# EasyEDA Pro project 电机线限位线中继板V1.0.eprj

# Schematic 原理图
Board Name: esp32; Create Date: 2025-05-14; Page Name: 电源; Project Name: 电机线限位线中继板V1.0; Schematic Name: 原理图; Update Date: 2025-10-10; Company: 嘉立创EDA; Page Size: A3; Version: V1.0
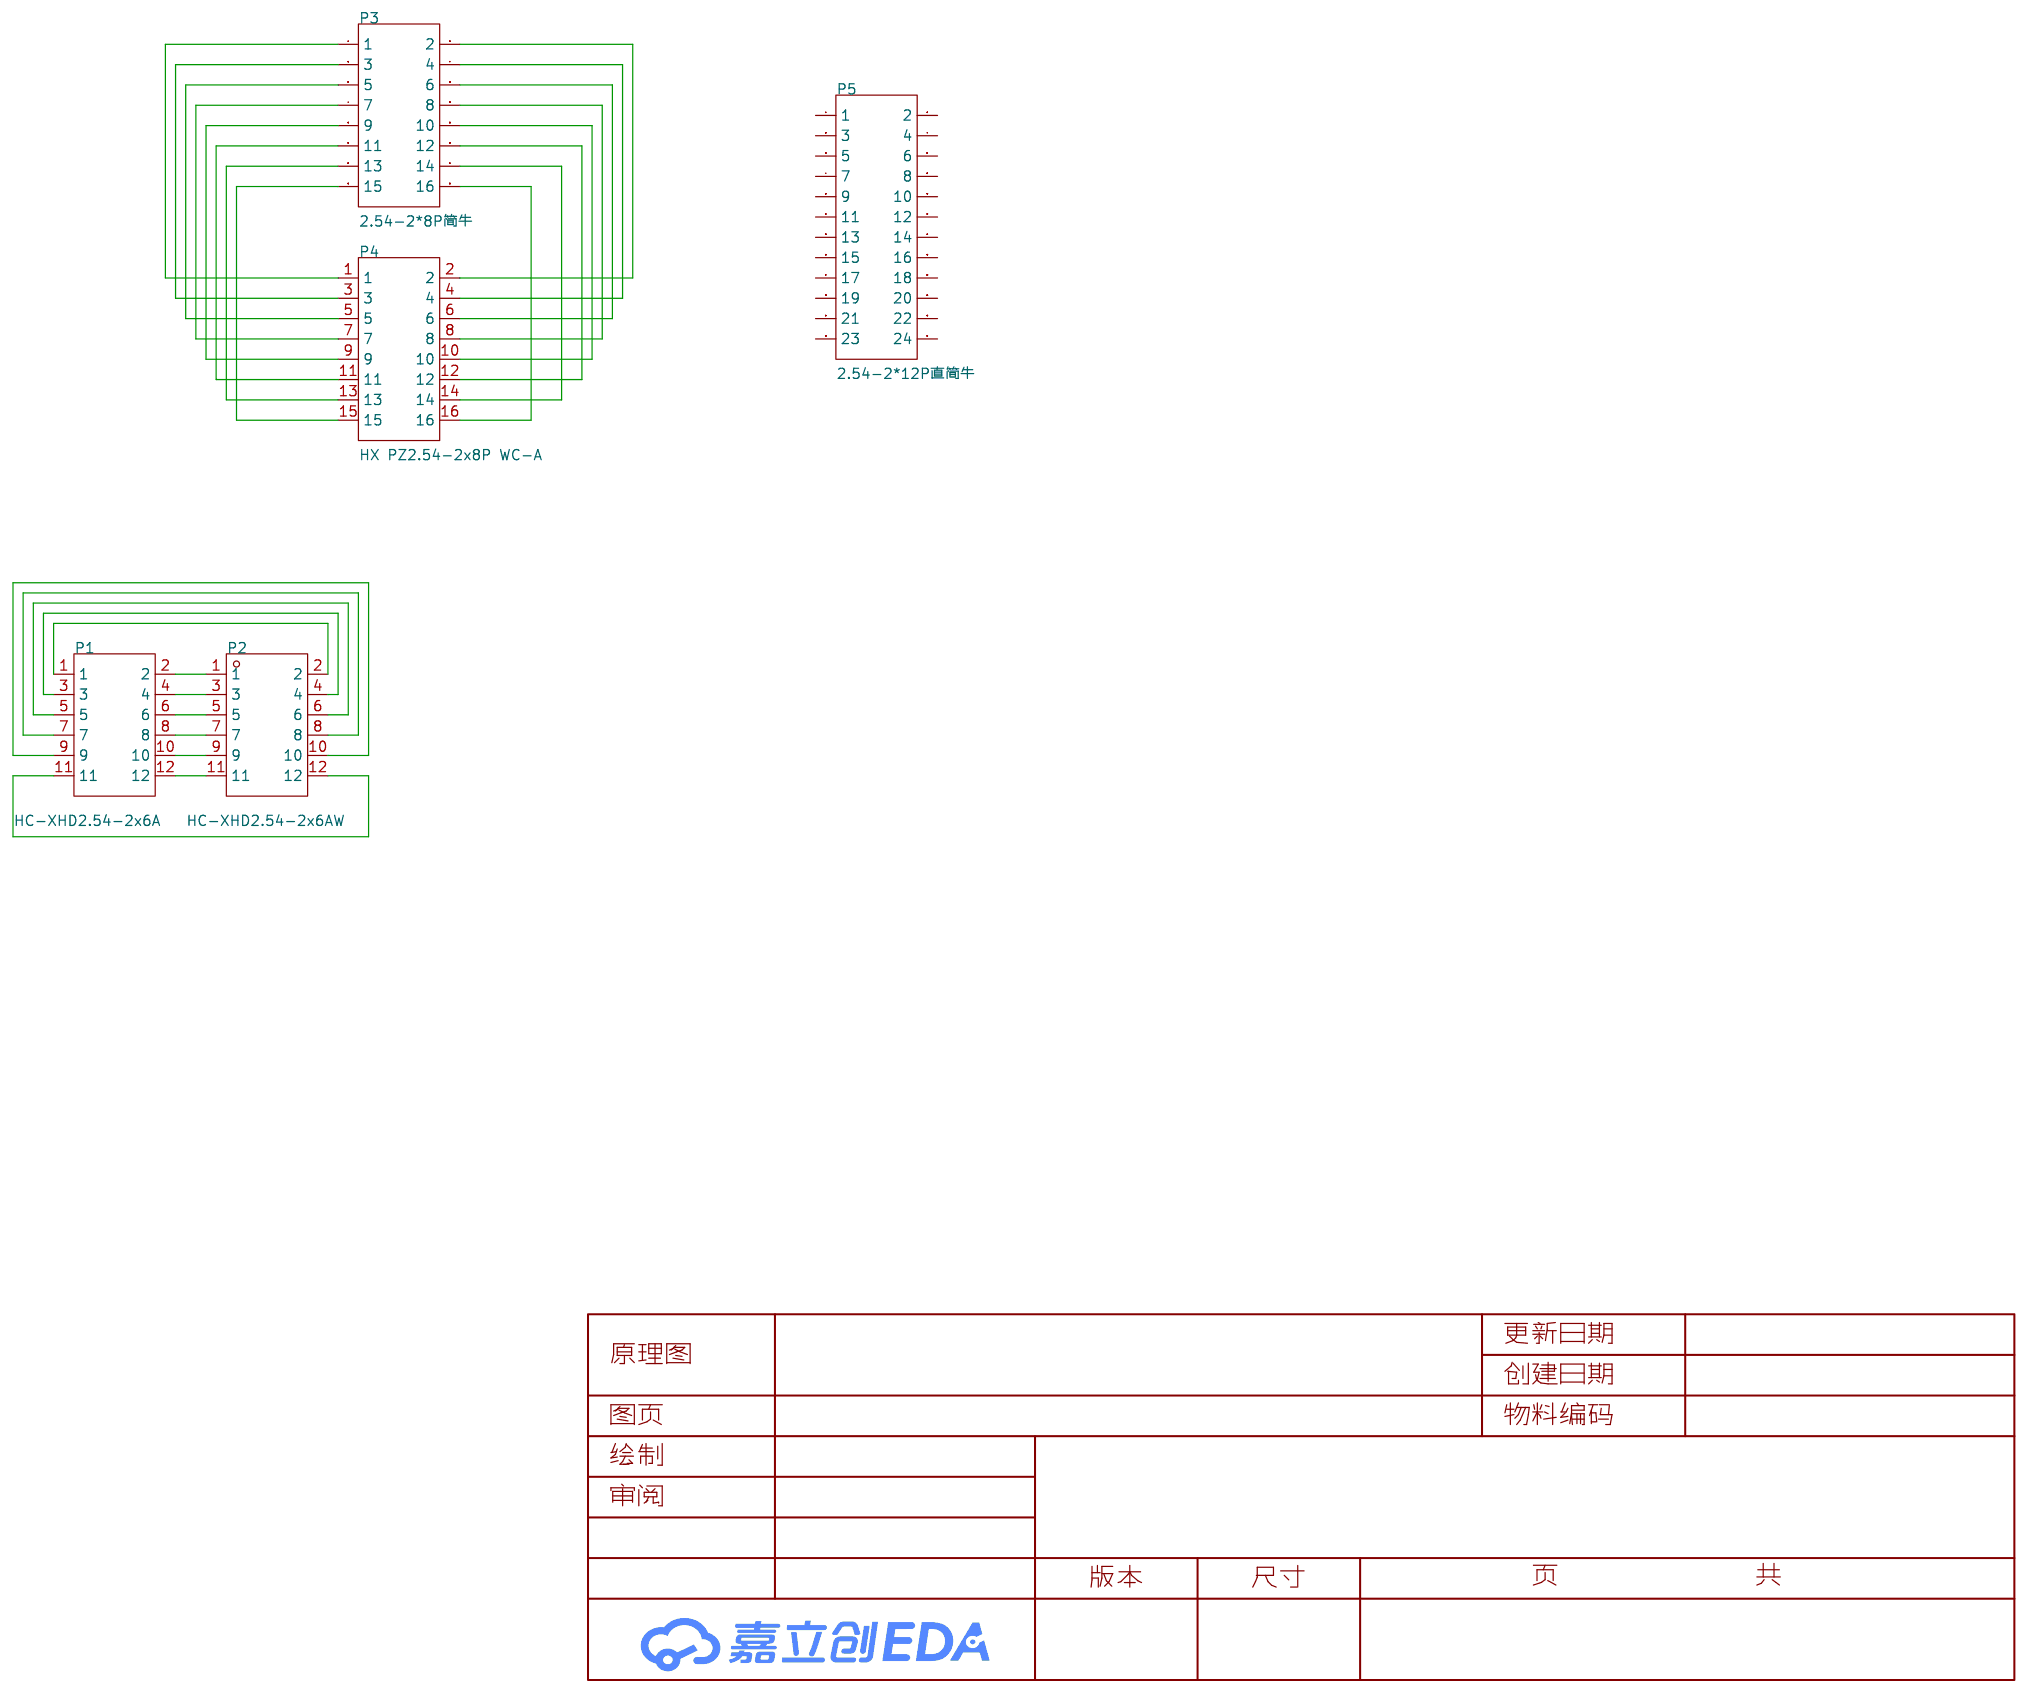
[diagram p0: schematic sheet]

## Parts
P1  HC-XHD2.54-2x6A  [CONN-TH_12P-P2.50_HC-XHD2.54-2X6A]
P2  HC-XHD2.54-2x6AW  [CONN-TH_12P-P2.50_HC-XHD2.54-2X6AW]
P3  2.54-2*8P简牛  [IDC-TH_16P-P2.54_C3406]
P4  HX PZ2.54-2x8P WC-A  [HDR-TH_16P-P2.54-H-M-R2-C8-S2.54-W12.9-N]
P5  2.54-2*12P直简牛  [IDC-TH_24P-P2.54-V-R2-C12-S2.54]

## Library data of the parts
P1 = HC-XHD2.54-2x6A: LCSC Part Name: 米色 2x6P 间距:2.5mm 直插; Supplier Part: C19273889; Manufacturer: HC(虹成电子); Supplier Footprint: 插件,P=2.5mm; JLCPCB Part Class: 扩展库; Datasheet: https://item.szlcsc.com/datasheet/HC-XHD2.54-2x6A/20558439.html; Supplier: LCSC; Pins Structure: 2x6P; Pitch: 2.5mm; Mounting Type: 直插; Number of Pins: 12P; Number of Rows: 2; Number of PINs Per Row: 6; Row Spacing: 2.5mm; Current Rating: 3A; Contact Material: 黄铜; Contact Plating: 锡; Operating Temperature: -25℃~+85℃; Voltage Rating: 250V; Plastic Material: PA66; Color: 米色; Z-Height of the Board: 9.5mm; X-Length of Bottom Edge on Board (Spacing Line): 17.5mm; Y-Width of Bottom Edge on Board: 8.6mm
P2 = HC-XHD2.54-2x6AW: LCSC Part Name: 米色 2x6P 间距:2.5mm 弯插; Supplier Part: C19273915; Manufacturer: HC(虹成电子); Supplier Footprint: 弯插,P=2.5mm; JLCPCB Part Class: 扩展库; Datasheet: https://item.szlcsc.com/datasheet/HC-XHD2.54-2x6AW/20558465.html; Supplier: LCSC; Pins Structure: 2x6P; Pitch: 2.5mm; Mounting Type: 弯插; Number of Pins: 12P; Number of Rows: 2; Number of PINs Per Row: 6; Row Spacing: 2.5mm; Current Rating: 3A; Contact Material: 黄铜; Contact Plating: 锡; Operating Temperature: -25℃~+85℃; Voltage Rating: 250V; Plastic Material: PA66; Color: 米色; Z-Height of the Board: 8.6mm; X-Length of Bottom Edge on Board (Spacing Line): 17.5mm; Y-Width of Bottom Edge on Board: 12.5mm
P3 = 2.54-2*8P简牛: LCSC Part Name: 2.54mm 2x8P 排数:2 每排P数:8; Supplier Part: C3406; Manufacturer: BOOMELE(博穆精密); Supplier Footprint: 插件,P=2.54mm; JLCPCB Part Class: 扩展库; Datasheet: https://item.szlcsc.com/datasheet/2.54-2*8P%25E7%25AE%2580%25E7%2589%259B/3807.html; Supplier: LCSC; Connector Type: 简牛座; Pitch: 2.54mm; Number of Positions or Pins: 2x8P; Holder Type: 直插; Row Spacing: 2.54mm; Number of Rows: 2; Number of PINs Per Row: 8
P4 = HX PZ2.54-2x8P WC-A: LCSC Part Name: 2x8P 间距:2.54mm 方针 弯插; Supplier Part: C41417356; Manufacturer: hanxia(韩下); Supplier Footprint: 弯插,P=2.54mm; Datasheet: https://item.szlcsc.com/datasheet/HX%2520PZ2.54-2x8P%2520WC-A/43243360.html; Supplier: LCSC; Pin Structure: 2x8P; Pitch: 2.54mm; Row Spacing: 2.54mm; Circluar Pins/Square Pins: 方针; Mounting Type: 弯插; Number of Rows: 双排; Number of Pins: 16P; Current Rating: 3A; Voltage Rating (Max): 1kV; Length of Mating Pin: 6mm; Insulation Height: 2.5mm; Contact Material: 黄铜; Contact Plating: 金; Operating Temperature: -40℃~+105℃; Color: 黑色
P5 = 2.54-2*12P直简牛: LCSC Part Name: 2.54mm 2x12P 排数:2 每排P数:12; Supplier Part: C9137; Manufacturer: BOOMELE(博穆精密); Supplier Footprint: 插件,P=2.54mm; JLCPCB Part Class: 扩展库; Datasheet: https://item.szlcsc.com/datasheet/2.54-2*12P%25E7%259B%25B4%25E7%25AE%2580%25E7%2589%259B/9660.html; Supplier: LCSC; Connector Type: 简牛座; Pitch: 2.54mm; Number of Positions or Pins: 2x12P; Current Rating: 1A; Holder Type: 直插; Row Spacing: 2.54mm; Number of Rows: 2; Number of PINs Per Row: 12; Contact Material: 黄铜; Contact Plating: 金; Operating Temperature: -55℃~+105℃; Color: 黑色

## Nets
$9N159778: P3.1 P4.1
$9N159784: P3.3 P4.3
$9N159794: P3.5 P4.5
$9N159800: P3.7 P4.7
$9N159807: P3.9 P4.9
$9N159814: P3.11 P4.11
$9N159821: P3.13 P4.13
$9N159828: P3.15 P4.15
$9N159835: P3.2 P4.2
$9N159845: P3.4 P4.4
$9N159852: P3.6 P4.6
$9N159859: P3.8 P4.8
$9N159866: P3.10 P4.10
$9N159876: P3.12 P4.12
$9N159883: P3.14 P4.14
$9N159893: P3.16 P4.16
$9N160061: P1.12 P2.11
$9N160063: P1.10 P2.9
$9N160065: P1.8 P2.7
$9N160067: P1.6 P2.5
$9N160069: P1.4 P2.3
$9N160071: P1.2 P2.1
$9N160075: P1.1 P2.2
$9N160084: P1.3 P2.4
$9N160093: P1.5 P2.6
$9N160108: P1.7 P2.8
$9N160122: P1.9 P2.10
$9N160138: P1.11 P2.12

Not connected (* = marked no-connect by the designer): P5 1 2 3 4 5 6 7 8 9 10 11 12 13 14 15 16 17 18 19 20 21 22 23 24

# Board PCB
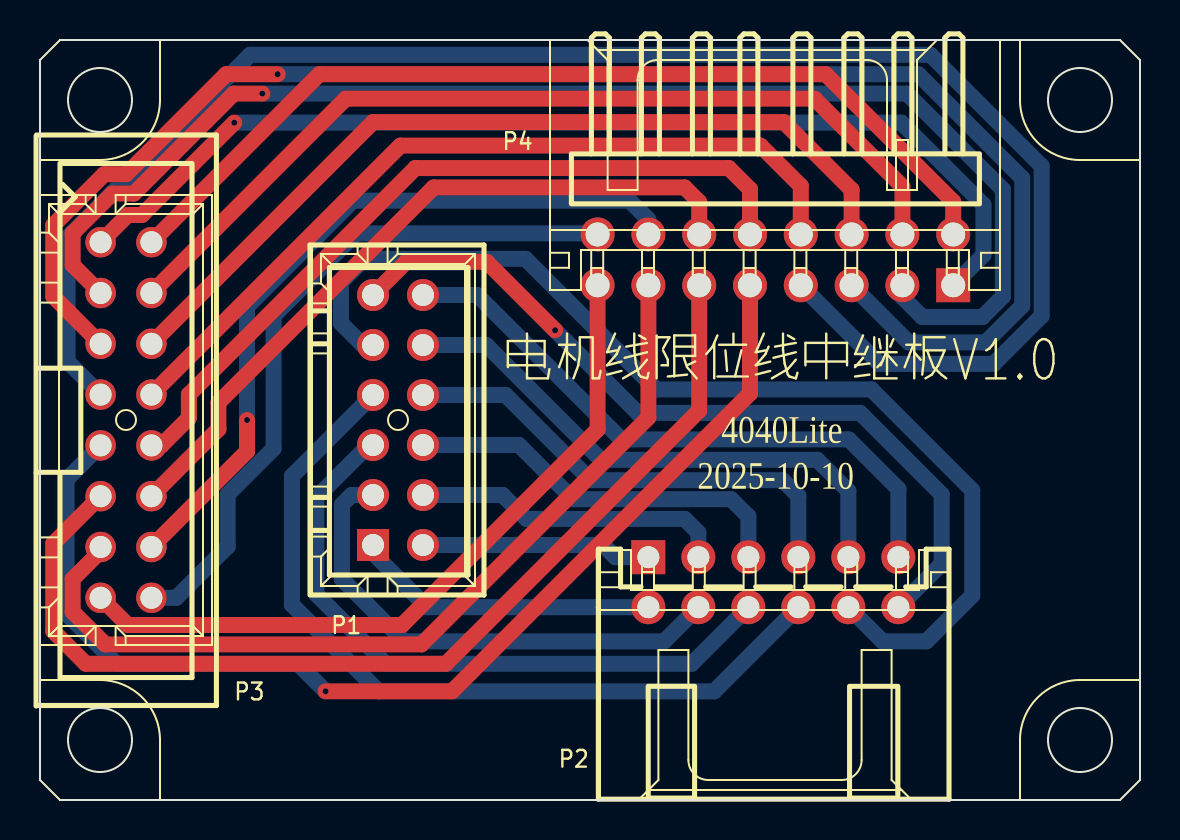
[diagram p1: board, top side]
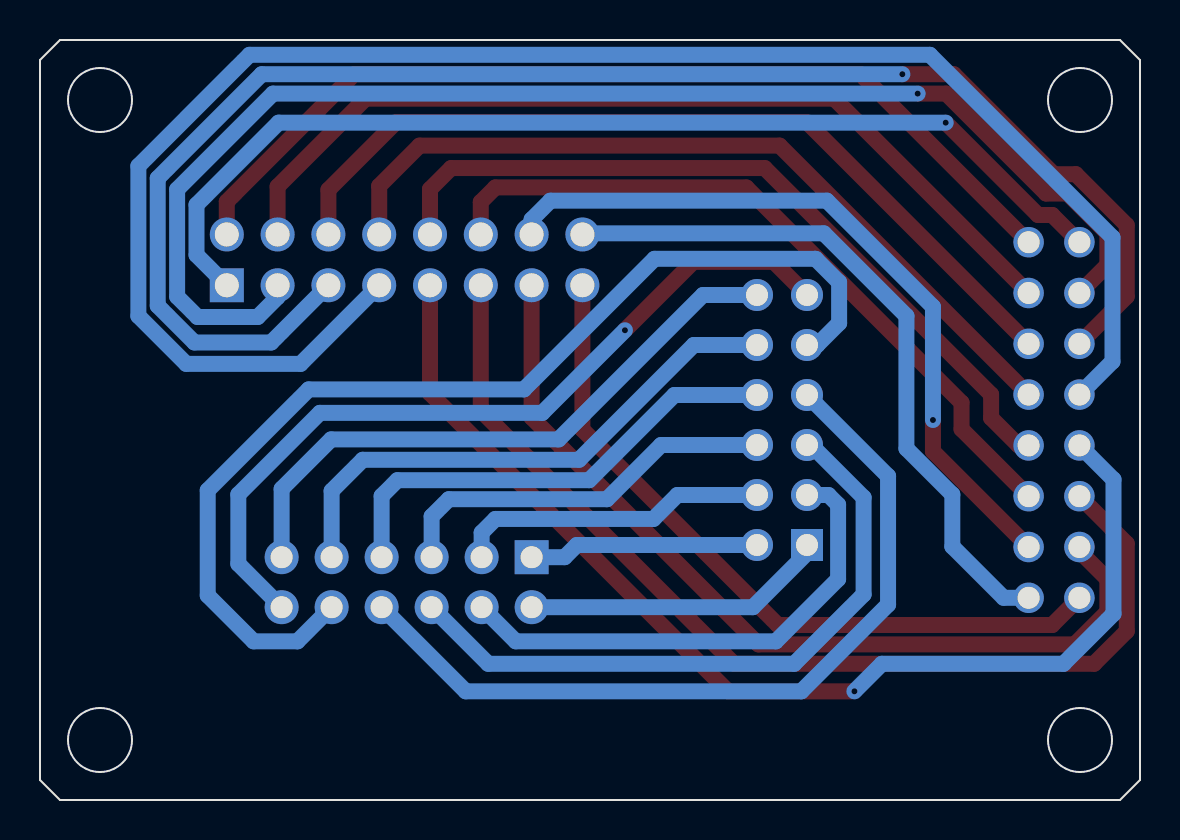
[diagram p2: board, bottom side, seen from below]

Outline 55 x 38 mm; copper layers: Top Layer, Bottom Layer. Coordinates in mm from the lower left corner of the outline.
Outline path: circle c3,35 r1.6 ; circle c3,3 r1.6 ; circle c52,35 r1.6 ; circle c52,3 r1.6 ; 0,25.87 0,37 1,38 44.85,38 ; 0,10.63 0,27.37 ; 0,12.13 0,1 1,0 43.58,0 ; 27.38,38 54,38 55,37 55,1 54,0 29.92,0
Stack: Top Layer 0.035mm / Dielectric1 1.51mm FR4 er 4.5 / Bottom Layer 0.035mm

## Design rules (mm)
template: 用户自定义配置
spacing Default (default): track to track 0.152, other pairs 0 to 0.152
track width Default (default): min 0.254, default 0.254, max 25.4
differential pair differentialPair (default): width min 0.127, default 0.254, max 2.54; gap min 0.152, default 0.152
via Default (default): diameter min 0.25, default 0.61, max 100.025; hole min 0.2, default 0.305, max 59.995

## Placement (name value [footprint] x y rotation side)
P1  HC-XHD2.54-2x6A  [CONN-TH_12P-P2.50_HC-XHD2.54-2X6A]  17.9 19 270 top
P2  HC-XHD2.54-2x6AW  [CONN-TH_12P-P2.50_HC-XHD2.54-2X6AW]  36.67 10.89 180 top
P3  2.54-2*8P简牛  [IDC-TH_16P-P2.54_C3406]  4.3 19 270 top
P4  HX PZ2.54-2x8P WC-A  [HDR-TH_16P-P2.54-H-M-R2-C8-S2.54-W12.9-N]  36.77 27.01 180 top

## Footprints (pads in the part's own frame, mm; a bottom-side part is the same pattern mirrored in y, then rotated)
CONN-TH_12P-P2.50_HC-XHD2.54-2X6A
  rect 1.6x1.6 hole 1.1: 1(6.25,-1.25)
  round 1.6 hole 1.1: 2(6.25,1.25) 3(3.75,-1.25) 4(3.75,1.25) 5(1.25,-1.25) 6(1.25,1.25) 7(-1.25,-1.25) 8(-1.25,1.25) 9(-3.75,-1.25) 10(-3.75,1.25) 11(-6.25,-1.25) 12(-6.25,1.25)
CONN-TH_12P-P2.50_HC-XHD2.54-2X6AW
  rect 1.7x1.7 hole 1.1: 1(6.25,-1.25)
  round 1.7 hole 1.1: 2(6.25,1.25) 3(3.75,-1.25) 4(3.75,1.25) 5(1.25,-1.25) 6(1.25,1.25) 7(-1.25,-1.25) 8(-1.25,1.25) 9(-3.75,-1.25) 10(-3.75,1.25) 11(-6.25,-1.25) 12(-6.25,1.25)
HDR-TH_16P-P2.54-H-M-R2-C8-S2.54-W12.9-N
  rect 1.7x1.7 hole 1.2: 1(-8.89,1.27)
  round 1.7 hole 1.2: 2(-8.89,-1.27) 3(-6.35,1.27) 4(-6.35,-1.27) 5(-3.81,1.27) 6(-3.81,-1.27) 7(-1.27,1.27) 8(-1.27,-1.27) 9(1.27,1.27) 10(1.27,-1.27) 11(3.81,1.27) 12(3.81,-1.27) 13(6.35,1.27) 14(6.35,-1.27) 15(8.89,1.27) 16(8.89,-1.27)
IDC-TH_16P-P2.54_C3406
  round 1.524 hole 1.1: 1(-8.89,-1.27) 2(-8.89,1.27) 3(-6.35,-1.27) 4(-6.35,1.27) 5(-3.81,-1.27) 6(-3.81,1.27) 7(-1.27,-1.27) 8(-1.27,1.27) 9(1.27,-1.27) 10(1.27,1.27) 11(3.81,-1.27) 12(3.81,1.27) 13(6.35,-1.27) 14(6.35,1.27) 15(8.89,-1.27) 16(8.89,1.27)

## Nets
As in the schematic.

## Via types
v1: diameter 0.6, hole 0.3, Top Layer to Bottom Layer, 6 vias

## Routing (per net, layer and track width the routed paths; a pad name or vN(x,y) marks a point on that pad's centre or on a via; arc(x,y) is an arc through that point)
$9N159778: length 53
  Top Layer w0.8: v1(9.71,33.87) 5.1,29.25 4.39,29.25 P3.1
  Bottom Layer w0.8: P4.1 47.17,27.25 47.17,29.76 43.07,33.87 v1(9.71,33.87)
$9N159784: length 66.8
  Top Layer w0.8: v1(11.12,35.32) 9.69,35.32 4.69,30.32 3.62,30.32 1.63,28.33 1.63,26.75 P3.3
  Bottom Layer w0.8: P4.3 43.12,25.15 44.11,24.15 47.12,24.15 48.14,25.17 48.14,30.53 43.35,35.32 v1(11.12,35.32)
$9N159794: length 77.5
  Top Layer w0.8: v1(11.88,36.29) 9.31,36.29 4.31,31.29 3.21,31.29 0.66,28.74 0.66,25.18 P3.5
  Bottom Layer w0.8: v1(11.88,36.29) 43.91,36.29 49.11,31.09 49.11,24.71 47.28,22.88 43.44,22.88 P4.5
$9N159800: length 85.5
  Bottom Layer w0.8: P3.7 1.38,21.92 1.38,28.13 10.5,37.26 44.52,37.26 50.08,31.7 50.08,24.2 47.68,21.81 41.97,21.81 P4.7
$9N159807: length 56.5
  Top Layer w0.8: v1(14.28,5.43) 20.6,5.43 35.5,20.33 P4.9
  Bottom Layer w0.8: v1(14.28,5.43) 12.9,6.81 3.82,6.81 1.33,9.31 1.33,16.03 P3.9
$9N159814: length 52.2
  Top Layer w0.8: P3.11 0.66,12.82 0.66,8.44 2.29,6.81 20.3,6.81 32.96,19.47 P4.11
$9N159821: length 44.6
  Top Layer w0.8: P4.13 30.42,19.13 19.07,7.78 3.26,7.78 1.63,9.41 1.63,11.04 3.03,12.44 P3.13
$9N159828: length 36.7
  Top Layer w0.8: P3.15 4.39,8.75 18.1,8.75 27.88,18.53 P4.15
$9N159835: length 47.8
  Top Layer w0.8: P4.2 45.66,29.92 39.29,36.29 13.97,36.29 P3.2
$9N159845: length 45.8
  Top Layer w0.8: P3.4 15.28,35.07 38.73,35.07 43.12,30.67 P4.4
$9N159852: length 43.2
  Top Layer w0.8: P4.6 40.58,30.51 37.2,33.89 16.65,33.89 P3.6
$9N159859: length 40.9
  Top Layer w0.8: P3.8 18.02,32.72 36.02,32.72 38.04,30.7 P4.8
$9N159866: length 39.1
  Top Layer w0.8: P4.10 35.5,30.54 34.44,31.6 18.77,31.6 7.44,20.28 7.44,19.1 6.07,17.73 P3.10
$9N159876: length 36.5
  Top Layer w0.8: P3.12 8.92,18.54 8.92,19.87 19.69,30.63 32.23,30.63 32.96,29.9 P4.12
$9N159883: length 37.4
  Top Layer w0.8: v1(10.35,19) 10.35,17.43 P3.14
  Bottom Layer w0.8: P4.14 30.42,29.02 29.48,29.97 15.66,29.97 10.35,24.66 v1(10.35,19)
$9N159893: length 35.3
  Bottom Layer w0.8: P4.16 27.82,28.33 15.81,28.33 11.68,24.2 11.68,17.57 9.38,15.28 9.38,12.68 6.82,10.11 P3.16
$9N160061: length 31.2
  Bottom Layer w0.8: P2.11 42.92,15.56 40.44,18.03 29.07,18.03 21.85,25.25 P1.12
$9N160063: length 27.6
  Bottom Layer w0.8: P2.9 40.42,15.45 38.86,17.01 28.05,17.01 22.31,22.75 P1.10
$9N160065: length 23.9
  Bottom Layer w0.8: P2.7 37.92,15.2 37.13,15.99 27.54,15.99 23.28,20.25 P1.8
$9N160067: length 19.8
  Bottom Layer w0.8: P1.6 23.94,17.75 26.66,15.04 34.56,15.04 35.42,14.18 P2.5
$9N160069: length 15.8
  Bottom Layer w0.8: P1.4 23.13,15.25 24.33,14.05 32.23,14.05 32.92,13.37 P2.3
$9N160071: length 11.5
  Bottom Layer w0.8: P1.2 28.16,12.75 28.77,12.14 P2.1
$9N160075: length 15.3
  Bottom Layer w0.8: P1.1 16.65,12.35 19.35,9.64 P2.2
$9N160084: length 25.3
  Bottom Layer w0.8: P2.4 31.21,7.93 18.21,7.93 15.09,11.04 15.09,14.77 15.58,15.25 P1.3
$9N160093: length 33
  Bottom Layer w0.8: P1.5 16.45,17.75 13.82,15.12 13.82,10.28 17.29,6.81 32.59,6.81 P2.6
$9N160108: length 41
  Bottom Layer w0.8: P2.8 33.71,5.43 16.93,5.43 12.6,9.77 12.6,16.2 P1.7
$9N160122: length 54.1
  Bottom Layer w0.8: P1.9 16.14,22.75 15.04,23.85 15.04,25.89 16.22,27.06 24.28,27.06 30.8,20.53 41.56,20.53 46.61,15.48 46.61,10.23 44.32,7.93 42.13,7.93 P2.10
$9N160138: length 40.5
  Top Layer w0.8: P1.11 18.31,26.91 22.34,26.91 v1(25.75,23.49)
  Bottom Layer w0.8: v1(25.75,23.49) 29.88,19.36 41,19.36 45.08,15.28 45.08,11.81 P2.12

## Text on the board
Top Silkscreen Layer: 2025-10-10 | 4040Lite | 电机线限位线中继板V1.0
